# Altium schematic sheet Main.SchDoc
size A4; SheetNumber: 1; SheetTotal: 3
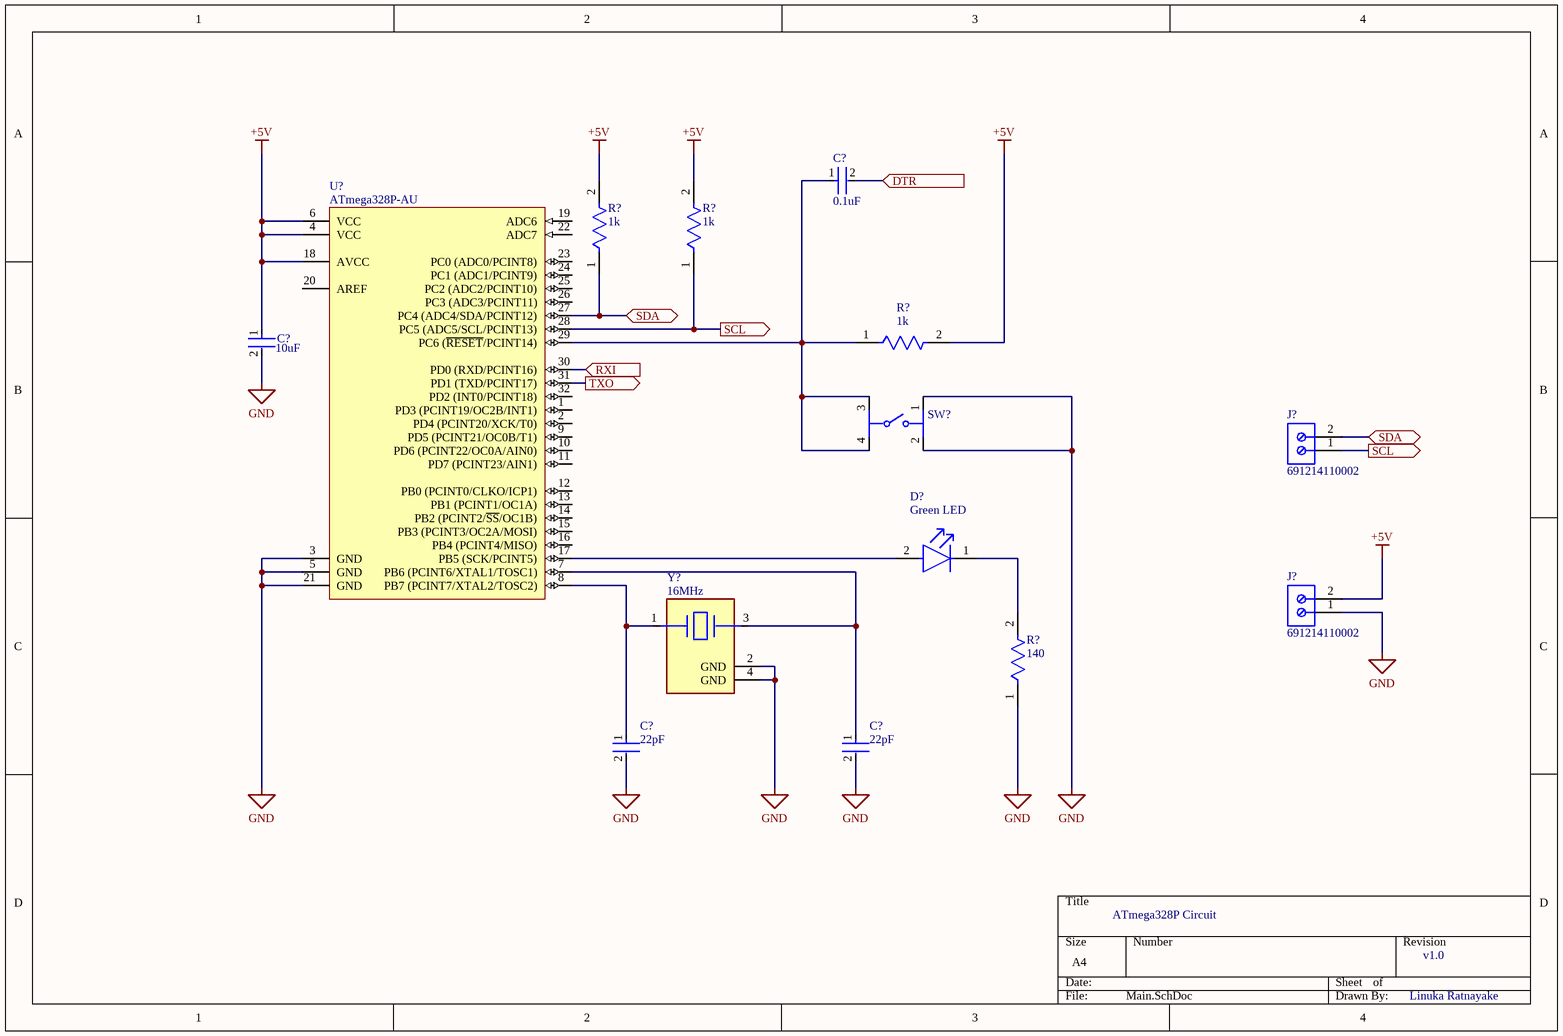
[diagram p0: Main.SchDoc]

## Parts
(Parts that share a designator on the sheet are numbered #1, #2 ... from top to bottom, then left to right.)
C?#1  Capacitance: 0.1uF  [FP-GRM31M-0_15-IPC_A]  (hidden comment: GRM31M1X1H104JA01L)
C?#2  Capacitance: 10uF  [FP-GRM31M-0_15-IPC_A]  (hidden comment: GRM31M1X1H104JA01L)
C?#3  Capacitance: 22pF  [FP-GRM31M-0_15-IPC_A]  (hidden comment: GRM31M1X1H104JA01L)
C?#4  Capacitance: 22pF  [FP-GRM31M-0_15-IPC_A]  (hidden comment: GRM31M1X1H104JA01L)
D?  Color: Green LED  [FP-HSMG-C150-MFG]  (hidden comment: HSMG-C150)
J?#1  691214110002  [691214110002]
J?#2  691214110002  [691214110002]
R?#1  Resistance: 1k  [FP-MCR18-IPC_B]  (hidden comment: MCR18EZPF30R0)
R?#2  Resistance: 1k  [FP-MCR18-IPC_B]  (hidden comment: MCR18EZPF30R0)
R?#3  Resistance: 1k  [FP-MCR18-IPC_B]  (hidden comment: MCR18EZPF30R0)
R?#4  Resistance: 140  [FP-MCR18-IPC_B]  (hidden comment: MCR18EZPF30R0)
SW?  PTS645SM43SMTR92LFS  [FP-PTS645SM43SMTR92LFS-MFG]  (value not drawn)
U?  ATmega328P-AU  [32A_M]
Y?  Frequency: 16MHz  [FP-ABM11-MFG]  (hidden comment: ABM11-16.000MHZ-12-N1G-T)

## Ports
DTR (in, see FTDI[3B]), RXI (in, see FTDI[3B]), SCL (out, see Main[2B]), SCL (out, see Main[4B]), SDA (bidir, see Main[2B]), SDA (bidir, see Main[4B]), TXO (out, see FTDI[3B])

## Nets
+5V: C?#2.1 J?#2.2 R?#1.2 R?#2.2 R?#3.2 U?.4(VCC) U?.6(VCC) U?.18(AVCC)
GND: C?#2.2 C?#3.2 C?#4.2 J?#2.1 R?#4.1 SW?.1 SW?.2 U?.3(GND) U?.5(GND) U?.21(GND) Y?.2(GND) Y?.4(GND)
DTR: C?#1.2 ; port DTR
RXI: U?.30(PD0_(RXD/PCINT16)) ; port RXI
SCL: J?#1.1 R?#2.1 U?.28(PC5_(ADC5/SCL/PCINT13)) ; port SCL
SDA: J?#1.2 R?#1.1 U?.27(PC4_(ADC4/SDA/PCINT12)) ; port SDA
TXO: U?.31(PD1_(TXD/PCINT17)) ; port TXO
NetC?#1_1: C?#1.1 R?#3.1 SW?.3 SW?.4 U?.29(PC6_(~{RESET}/PCINT14))
NetC?#3_1: C?#3.1 U?.8(PB7_(PCINT7/XTAL2/TOSC2)) Y?.1
NetC?#4_1: C?#4.1 U?.7(PB6_(PCINT6/XTAL1/TOSC1)) Y?.3
NetD?_1: D?.1(C) R?#4.2
NetD?_2: D?.2(A) U?.17(PB5_(SCK/PCINT5))

Not connected (* = marked no-connect by the designer): U? 1(PD3_(PCINT19/OC2B/INT1)) 2(PD4_(PCINT20/XCK/T0)) 9(PD5_(PCINT21/OC0B/T1)) 10(PD6_(PCINT22/OC0A/AIN0)) 11(PD7_(PCINT23/AIN1)) 12(PB0_(PCINT0/CLKO/ICP1)) 13(PB1_(PCINT1/OC1A)) 14(PB2_(PCINT2/~{SS}/OC1B)) 15(PB3_(PCINT3/OC2A/MOSI)) 16(PB4_(PCINT4/MISO)) 19(ADC6) 20(AREF) 22(ADC7) 23(PC0_(ADC0/PCINT8)) 24(PC1_(ADC1/PCINT9)) 25(PC2_(ADC2/PCINT10)) 26(PC3_(ADC3/PCINT11)) 32(PD2_(INT0/PCINT18))

## Notes on the sheet
- ATmega328P Circuit
- v1.0
- Linuka Ratnayake

## Library data of the parts
C?#1-C?#4 = CMP-06035-007547-1: Chip Multilayer Ceramic Capacitors for General Purpose, 1206, 0.10uF, SL, +350/-1000ppm/°C, 5%, 50V; Dissipation Factor: 0.025%; Packaging: Tape and Reel; Length: 0.126inch; Case Code (Imperial): 1206; Voltage Rating (DC): 50V; Max Operating Temperature: 125°C; Voltage: 50V; Height: 1.15mm; Width: 0.063inch; Voltage Rating: 50V; Tolerance: 5%; Min Operating Temperature: -55°C; Mount: Surface Mount; Dielectric Material: Ceramic; Termination: SMD/SMT; Depth: 1.6mm; Case Code (Metric): 3216; Case/Package: 1206; Temperature Coefficient: -1000ppm/°C; Thickness: 0.049inch
D? = CMP-2000-05061-2: LED GREEN DIFFUSED 1206 SMD; Manufacturer: Broadcom; Led Orientation: Top View; Max Junction Temp: +95°C; Peak Emmision Wavelength: 570nm; Viewing Angle: 170°; Wavelength: 572nm; Reverse Voltage: 5V; Luminous Intensity: 15mcd; Description: Surface Mount Chip LEDs; Forward Voltage: 2.2V; Power Dissipation: 65mW; Forward Current: 20mA; ComponentLink2Description: Datasheet; Lead Free: Yes; Temperature Range Low: -40°C; Package: HSMG-C150; Digikey Description: LED GREEN DIFFUSED 1206 SMD; Mouser Description: LED Uni-Color Green 570nm 2-Pin Chip LED T/R; Manufacturer Part Number: HSMG-C150; Temperature Range High: +85°C; Device Class L1: Optoelectronics; Colour: Green; Category: Diode; Device Class L3: unset; RoHS: TRUE; Height: 1.2mm; ComponentLink2URL: https://docs.broadcom.com/docs/AV02-0551EN; Device Class L2: LEDs; Automotive: No; Ipc Land Pattern Name: DIOCP320160X55; Octopart: https://octopart.com/hsmg-c150-broadcom-71131304; Temperature: -40°C to +85°C
J?#1 J?#2 = CMP-1502-02464-2: NexarPartId: 18818288; Plating: Brass, Steel; Current: 10A; Pitch: 3.5052mm; Number of Levels: 1; Number of Contacts: 2; Wire Gauge (Min): 16AWG; Voltage: 300V; Wire Gauge (Max): 24AWG; Stripping Length: -6mm; Number of Pins: 2; Number of Rows: 1; REACH SVHC: Unknown; RoHS: Compliant; Housing Material: Nylon; Termination: Screw; Mount: Through Hole; Contact Plating: Brass, Tin; Number of Positions Per Level: 2; Color: Blue, Green; Width: 7.9mm; Voltage Rating: 300V; Length: 7.4mm; Current Rating: 10A; Wire/Cable Gauge: 24AWG; Packaging: Box; Max Operating Temperature: 105°C; Lead Pitch: 3.5mm; Height: 8.7mm; Contact Material: Brass; Min Operating Temperature: -40°C
R?#1-R?#4 = CMP-08839-012195-1: Thick Film Chip Resistor, 1206, 30Ω, 1%, 100ppm/°C, 0.25W, 200V; Max Power Dissipation: 250mW; Case Code (Imperial): 1206; Case Code (Metric): 3216; Resistor Type: Thick Film; Tolerance: 1%; Package Quantity: 5000; Height: 0.026inch; RoHS Compliant: Yes; Series: MCR18; Number of Terminations: 2; Lead Free: Lead Free; Width: 0.063inch; Length: 0.126inch; Case/Package: 1206; Packaging: Tape and Reel; Features: Automotive AEC-Q200; Voltage Rating (DC): 200V; Temperature Coefficient: 100ppm/°C
SW? = CMP-2000-05160-2: SWITCH TACTILE SPST-NO 0.05A 12V; Contact Resistance: 100mR; Throw Configuration: SPST; Illumination Type: Non-Illuminated; Mechanical Life: 100000Cycles; Current Rating: 50mA; Switch Function: Off-Mom; Actuator Length: 0.85mm; Actuator Material: Nylon; Actuator Type: Standard; Operating Force: 160gf; Min Operating Temperature: -20°C; REACH SVHC: No SVHC; Termination: Gull Wing; Case/Package: SMD/SMT; Packaging: Tape and Reel; Mount: Surface Mount; Voltage Rating (DC): 12V; Orientation: Straight; Lead Free: Lead Free; Contact Material: Silver; Color: Black; Max Current Rating: 50mA; Contact Plating: Silver; Depth: 9mm; Package Quantity: 1; Max Voltage Rating (DC): 12V; Length: 6mm; Max Operating Temperature: 60°C
U? = CMP-0095-00269-2: 8-bit AVR Microcontroller, 32KB Flash, 1KB EEPROM, 2KB SRAM, 32-pin TQFP, Industrial Grade (-40°C to 85°C); PackageDescription: 32-Lead, 7x7x1.0 mm Body, 0.8mm Lead Pitch, Thin Profile Plastic Quad Flat Package (TQFP); DatasheetVersion: revD, May-2011; RevisionNote: DatasheetVersion & PackageVersion updated. URLs added.; ComponentLink1URL: http://www.atmel.com/; ComponentLink2Description: ATmega48A/48PA/88A/88PA/168A/168PA/328/328P Datasheet; Code_JEDEC: MS-026-ABA; ComponentLink1Description: Manufacturer URL; PackageReference: 32A; ComponentLink3Description: ATmega48A/48PA/88A/88PA/168A/168PA/328/328P Summary; ComponentLink2URL: http://www.atmel.com/dyn/resources/prod_documents/doc8271.pdf; PackageVersion: revC, Oct-2010; ComponentLink3URL: http://www.atmel.com/dyn/resources/prod_documents/8271S.pdf
Y? = CMP-27762-009218-1: Crystal 16MHz ±10ppm 12pF SMD-4 2mm x 1.6mm